# Altium project RGB-Cube.PrjPcb
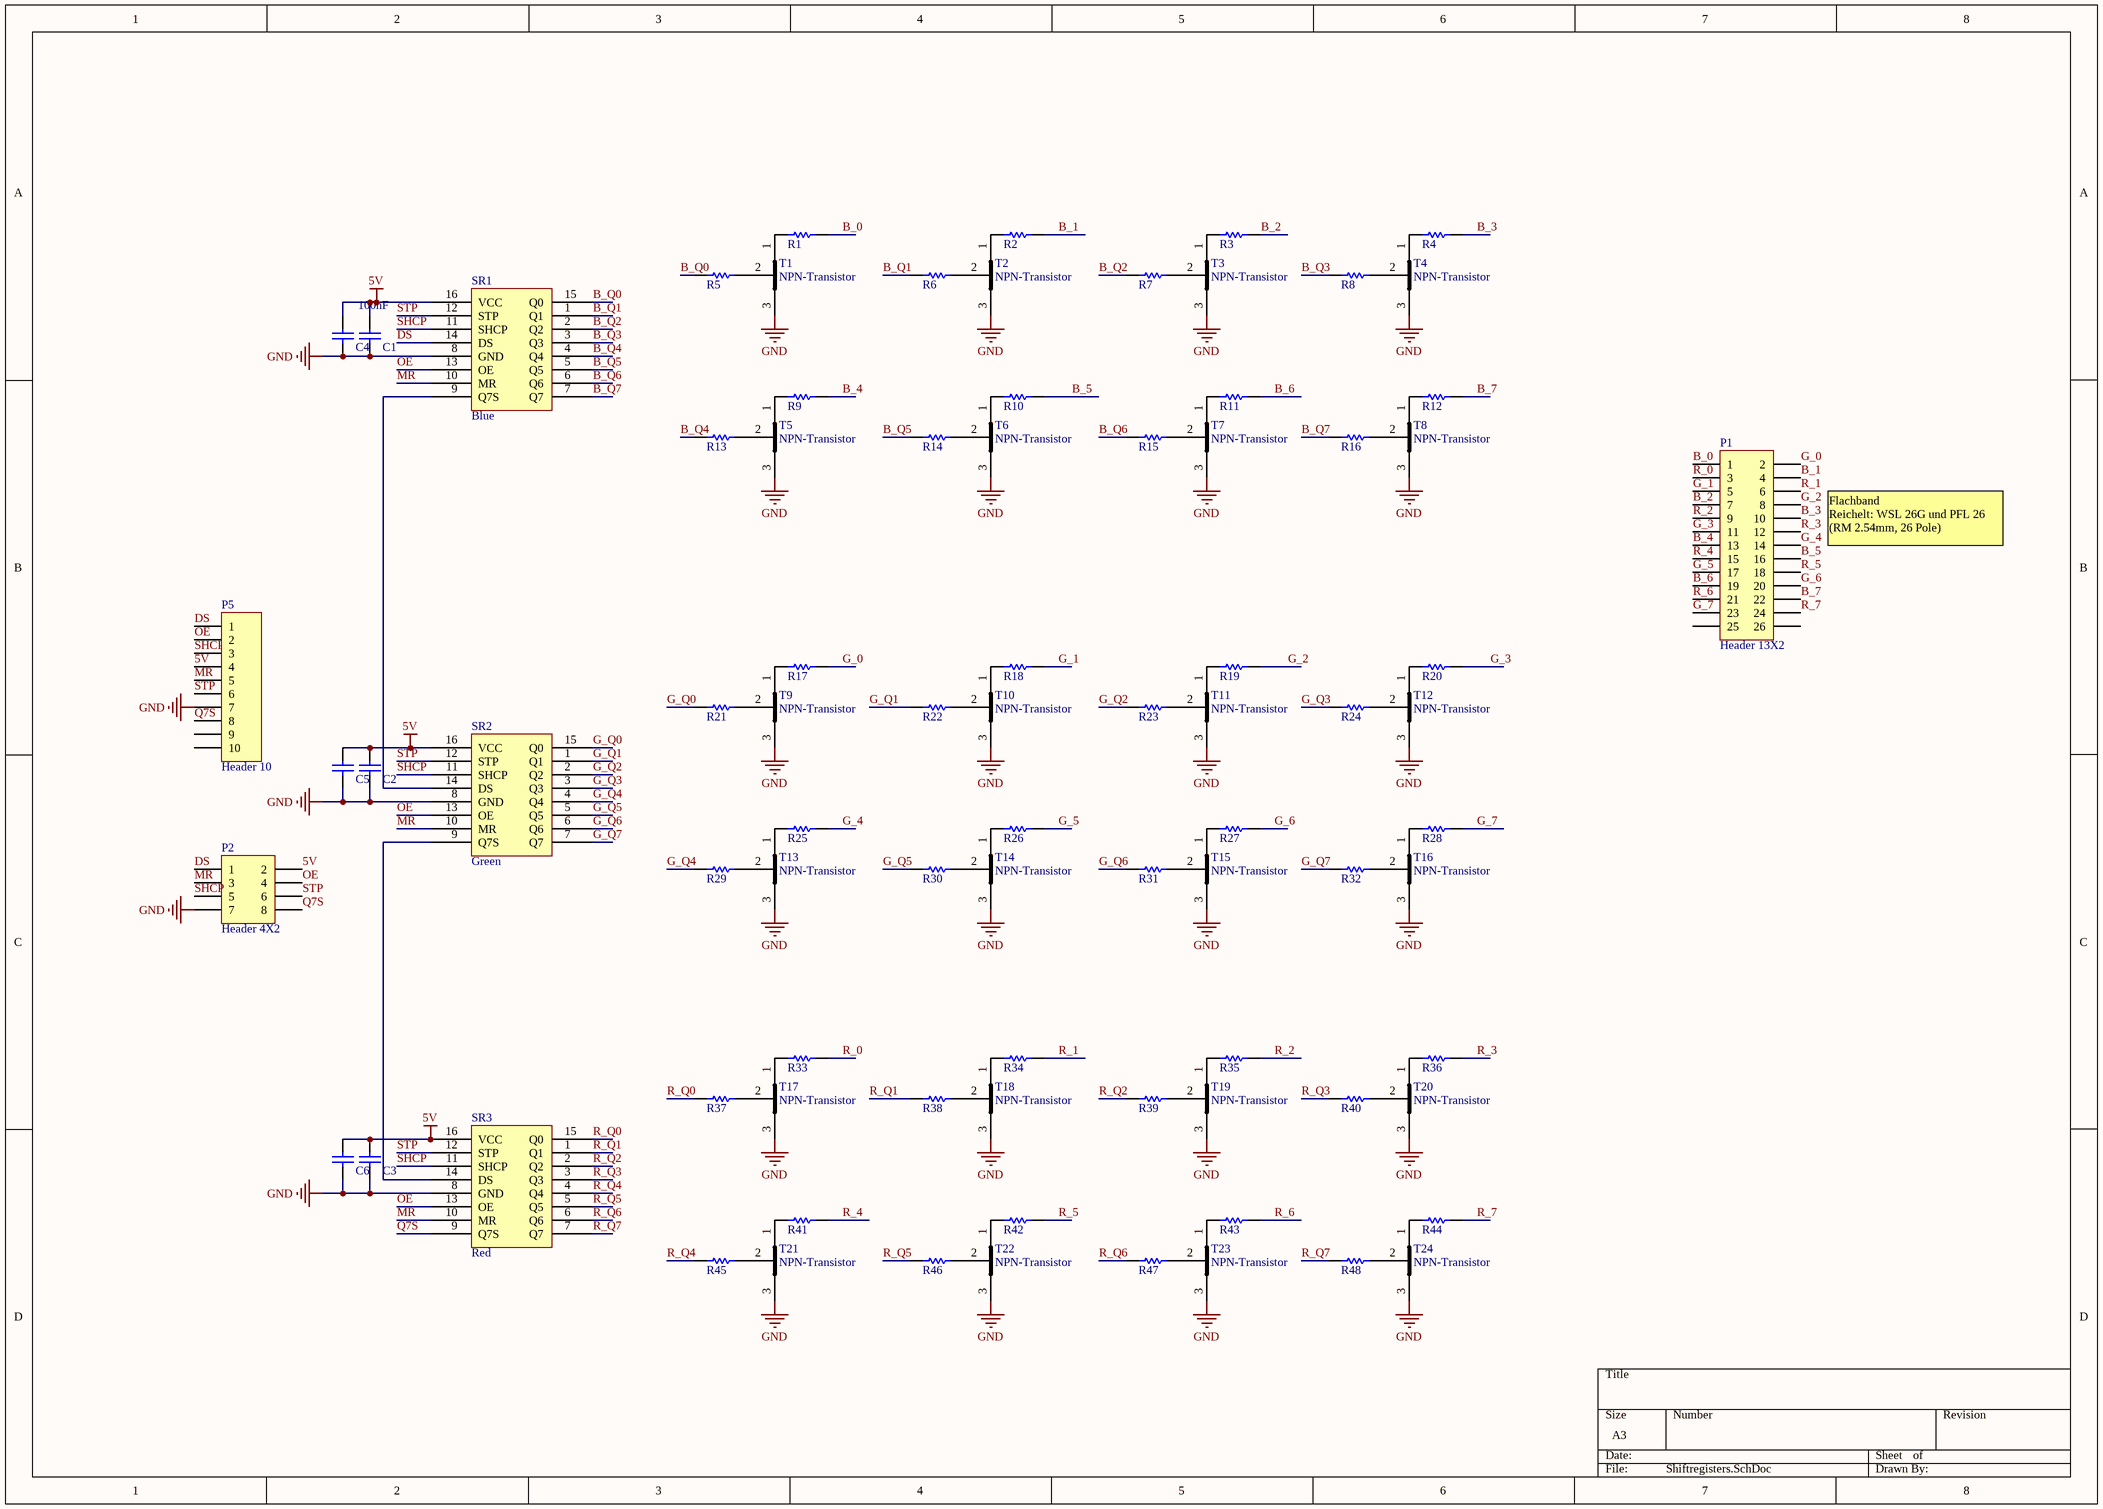
[diagram p0: Shiftregisters.SchDoc]
1 sheet, 84 parts. Net scope: global (net labels, ports and power ports of the same name join across sheets).
Board file: Shiftregisters.PcbDoc

## Sheet Shiftregisters.SchDoc
size A3

### Parts
C1  value 100nF  [CAPC1206(3216)190_L]  (hidden comment: CAP 100nF 16V 1206(3216))
C2  CAP 100nF 16V 1206(3216)  [CAPC1206(3216)190_L]  (value not drawn)
C3  CAP 100nF 16V 1206(3216)  [CAPC1206(3216)190_L]  (value not drawn)
C4  CAP 1uF 16V 1206(3216)  [CAPC1206(3216)150_N]  (value not drawn)
C5  CAP 1uF 16V 1206(3216)  [CAPC1206(3216)150_N]  (value not drawn)
C6  CAP 1uF 16V 1206(3216)  [CAPC1206(3216)150_N]  (value not drawn)
P1  Header 13X2  [HDR2X13]
P2  Header 4X2  [HDR2X4]
P5  Header 10  [10Pol Phoenix]
R1  2R 5% 1206(3216)  [RESC1206(3216)_M]  (value not drawn)
R2  2R 5% 1206(3216)  [RESC1206(3216)_M]  (value not drawn)
R3  2R 5% 1206(3216)  [RESC1206(3216)_M]  (value not drawn)
R4  2R 5% 1206(3216)  [RESC1206(3216)_M]  (value not drawn)
R5  2R 5% 1206(3216)  [RESC1206(3216)_M]  (value not drawn)
R6  2R 5% 1206(3216)  [RESC1206(3216)_M]  (value not drawn)
R7  2R 5% 1206(3216)  [RESC1206(3216)_M]  (value not drawn)
R8  2R 5% 1206(3216)  [RESC1206(3216)_M]  (value not drawn)
R9  2R 5% 1206(3216)  [RESC1206(3216)_M]  (value not drawn)
R10  2R 5% 1206(3216)  [RESC1206(3216)_M]  (value not drawn)
R11  2R 5% 1206(3216)  [RESC1206(3216)_M]  (value not drawn)
R12  2R 5% 1206(3216)  [RESC1206(3216)_M]  (value not drawn)
R13  2R 5% 1206(3216)  [RESC1206(3216)_M]  (value not drawn)
R14  2R 5% 1206(3216)  [RESC1206(3216)_M]  (value not drawn)
R15  2R 5% 1206(3216)  [RESC1206(3216)_M]  (value not drawn)
R16  2R 5% 1206(3216)  [RESC1206(3216)_M]  (value not drawn)
R17  2R 5% 1206(3216)  [RESC1206(3216)_M]  (value not drawn)
R18  2R 5% 1206(3216)  [RESC1206(3216)_M]  (value not drawn)
R19  2R 5% 1206(3216)  [RESC1206(3216)_M]  (value not drawn)
R20  2R 5% 1206(3216)  [RESC1206(3216)_M]  (value not drawn)
R21  2R 5% 1206(3216)  [RESC1206(3216)_M]  (value not drawn)
R22  2R 5% 1206(3216)  [RESC1206(3216)_M]  (value not drawn)
R23  2R 5% 1206(3216)  [RESC1206(3216)_M]  (value not drawn)
R24  2R 5% 1206(3216)  [RESC1206(3216)_M]  (value not drawn)
R25  2R 5% 1206(3216)  [RESC1206(3216)_M]  (value not drawn)
R26  2R 5% 1206(3216)  [RESC1206(3216)_M]  (value not drawn)
R27  2R 5% 1206(3216)  [RESC1206(3216)_M]  (value not drawn)
R28  2R 5% 1206(3216)  [RESC1206(3216)_M]  (value not drawn)
R29  2R 5% 1206(3216)  [RESC1206(3216)_M]  (value not drawn)
R30  2R 5% 1206(3216)  [RESC1206(3216)_M]  (value not drawn)
R31  2R 5% 1206(3216)  [RESC1206(3216)_M]  (value not drawn)
R32  2R 5% 1206(3216)  [RESC1206(3216)_M]  (value not drawn)
R33  2R 5% 1206(3216)  [RESC1206(3216)_M]  (value not drawn)
R34  2R 5% 1206(3216)  [RESC1206(3216)_M]  (value not drawn)
R35  2R 5% 1206(3216)  [RESC1206(3216)_M]  (value not drawn)
R36  2R 5% 1206(3216)  [RESC1206(3216)_M]  (value not drawn)
R37  2R 5% 1206(3216)  [RESC1206(3216)_M]  (value not drawn)
R38  2R 5% 1206(3216)  [RESC1206(3216)_M]  (value not drawn)
R39  2R 5% 1206(3216)  [RESC1206(3216)_M]  (value not drawn)
R40  2R 5% 1206(3216)  [RESC1206(3216)_M]  (value not drawn)
R41  2R 5% 1206(3216)  [RESC1206(3216)_M]  (value not drawn)
R42  2R 5% 1206(3216)  [RESC1206(3216)_M]  (value not drawn)
R43  2R 5% 1206(3216)  [RESC1206(3216)_M]  (value not drawn)
R44  2R 5% 1206(3216)  [RESC1206(3216)_M]  (value not drawn)
R45  2R 5% 1206(3216)  [RESC1206(3216)_M]  (value not drawn)
R46  2R 5% 1206(3216)  [RESC1206(3216)_M]  (value not drawn)
R47  2R 5% 1206(3216)  [RESC1206(3216)_M]  (value not drawn)
R48  2R 5% 1206(3216)  [RESC1206(3216)_M]  (value not drawn)
SR1  Blue  [SOP16]
SR2  Green  [SOP16]
SR3  Red  [SOP16]
T1  NPN-Transistor  [2N3904 - duplicate]
T2  NPN-Transistor  [2N3904 - duplicate]
T3  NPN-Transistor  [2N3904 - duplicate]
T4  NPN-Transistor  [2N3904 - duplicate]
T5  NPN-Transistor  [2N3904 - duplicate]
T6  NPN-Transistor  [2N3904 - duplicate]
T7  NPN-Transistor  [2N3904 - duplicate]
T8  NPN-Transistor  [2N3904 - duplicate]
T9  NPN-Transistor  [2N3904 - duplicate]
T10  NPN-Transistor  [2N3904 - duplicate]
T11  NPN-Transistor  [2N3904 - duplicate]
T12  NPN-Transistor  [2N3904 - duplicate]
T13  NPN-Transistor  [2N3904 - duplicate]
T14  NPN-Transistor  [2N3904 - duplicate]
T15  NPN-Transistor  [2N3904 - duplicate]
T16  NPN-Transistor  [2N3904 - duplicate]
T17  NPN-Transistor  [2N3904 - duplicate]
T18  NPN-Transistor  [2N3904 - duplicate]
T19  NPN-Transistor  [2N3904 - duplicate]
T20  NPN-Transistor  [2N3904 - duplicate]
T21  NPN-Transistor  [2N3904 - duplicate]
T22  NPN-Transistor  [2N3904 - duplicate]
T23  NPN-Transistor  [2N3904 - duplicate]
T24  NPN-Transistor  [2N3904 - duplicate]

### Nets
5V: C1.2 C2.1 C3.2 C4.2 C5.2 C6.2 P2.2 P5.4 SR1.16(VCC) SR2.16(VCC) SR3.16(VCC)
GND: C1.1 C2.2 C3.1 C4.1 C5.1 C6.1 P2.7 P5.7 SR1.8(GND) SR2.8(GND) SR3.8(GND) T1.3 T2.3 T3.3 T4.3 T5.3 T6.3 T7.3 T8.3 T9.3 T10.3 T11.3 T12.3 T13.3 T14.3 T15.3 T16.3 T17.3 T18.3 T19.3 T20.3 T21.3 T22.3 T23.3 T24.3
B_0: P1.1 R1.1
B_1: P1.4 R2.1
B_2: P1.7 R3.1
B_3: P1.10 R4.1
B_4: P1.13 R9.1
B_5: P1.16 R10.1
B_6: P1.19 R11.1
B_7: P1.22 R12.1
B_Q0: R5.1 SR1.15(Q0)
B_Q1: R6.1 SR1.1(Q1)
B_Q2: R7.1 SR1.2(Q2)
B_Q3: R8.1 SR1.3(Q3)
B_Q4: R13.1 SR1.4(Q4)
B_Q5: R14.1 SR1.5(Q5)
B_Q6: R15.1 SR1.6(Q6)
B_Q7: R16.1 SR1.7(Q7)
DS: P2.1 P5.1 SR1.14(DS)
G_0: P1.2 R17.1
G_1: P1.5 R18.1
G_2: P1.8 R19.1
G_3: P1.11 R20.1
G_4: P1.14 R25.1
G_5: P1.17 R26.1
G_6: P1.20 R27.1
G_7: P1.23 R28.1
G_Q0: R21.1 SR2.15(Q0)
G_Q1: R22.1 SR2.1(Q1)
G_Q2: R23.1 SR2.2(Q2)
G_Q3: R24.1 SR2.3(Q3)
G_Q4: R29.1 SR2.4(Q4)
G_Q5: R30.1 SR2.5(Q5)
G_Q6: R31.1 SR2.6(Q6)
G_Q7: R32.1 SR2.7(Q7)
MR: P2.3 P5.5 SR1.10(MR) SR2.10(MR) SR3.10(MR)
OE: P2.4 P5.2 SR1.13(OE) SR2.13(OE) SR3.13(OE)
Q7S: P2.8 P5.8 SR3.9(Q7S)
R_0: P1.3 R33.1
R_1: P1.6 R34.1
R_2: P1.9 R35.1
R_3: P1.12 R36.1
R_4: P1.15 R41.1
R_5: P1.18 R42.1
R_6: P1.21 R43.1
R_7: P1.24 R44.1
R_Q0: R37.1 SR3.15(Q0)
R_Q1: R38.1 SR3.1(Q1)
R_Q2: R39.1 SR3.2(Q2)
R_Q3: R40.1 SR3.3(Q3)
R_Q4: R45.1 SR3.4(Q4)
R_Q5: R46.1 SR3.5(Q5)
R_Q6: R47.1 SR3.6(Q6)
R_Q7: R48.1 SR3.7(Q7)
SHCP: P2.5 P5.3 SR1.11(SHCP) SR2.11(SHCP) SR3.11(SHCP)
STP: P2.6 P5.6 SR1.12(STP) SR2.12(STP) SR3.12(STP)
NetR1_2: R1.2 T1.1
NetR2_2: R2.2 T2.1
NetR3_2: R3.2 T3.1
NetR4_2: R4.2 T4.1
NetR5_2: R5.2 T1.2
NetR6_2: R6.2 T2.2
NetR7_2: R7.2 T3.2
NetR8_2: R8.2 T4.2
NetR9_2: R9.2 T5.1
NetR10_2: R10.2 T6.1
NetR11_2: R11.2 T7.1
NetR12_2: R12.2 T8.1
NetR13_2: R13.2 T5.2
NetR14_2: R14.2 T6.2
NetR15_2: R15.2 T7.2
NetR16_2: R16.2 T8.2
NetR17_2: R17.2 T9.1
NetR18_2: R18.2 T10.1
NetR19_2: R19.2 T11.1
NetR20_2: R20.2 T12.1
NetR21_2: R21.2 T9.2
NetR22_2: R22.2 T10.2
NetR23_2: R23.2 T11.2
NetR24_2: R24.2 T12.2
NetR25_2: R25.2 T13.1
NetR26_2: R26.2 T14.1
NetR27_2: R27.2 T15.1
NetR28_2: R28.2 T16.1
NetR29_2: R29.2 T13.2
NetR30_2: R30.2 T14.2
NetR31_2: R31.2 T15.2
NetR32_2: R32.2 T16.2
NetR33_2: R33.2 T17.1
NetR34_2: R34.2 T18.1
NetR35_2: R35.2 T19.1
NetR36_2: R36.2 T20.1
NetR37_2: R37.2 T17.2
NetR38_2: R38.2 T18.2
NetR39_2: R39.2 T19.2
NetR40_2: R40.2 T20.2
NetR41_2: R41.2 T21.1
NetR42_2: R42.2 T22.1
NetR43_2: R43.2 T23.1
NetR44_2: R44.2 T24.1
NetR45_2: R45.2 T21.2
NetR46_2: R46.2 T22.2
NetR47_2: R47.2 T23.2
NetR48_2: R48.2 T24.2
NetSR1_9: SR1.9(Q7S) SR2.14(DS)
NetSR2_9: SR2.9(Q7S) SR3.14(DS)

Not connected (* = marked no-connect by the designer): P1 25 26; P5 9 10

### Notes on the sheet
- Flachband
  Reichelt: WSL 26G und PFL 26
  (RM 2.54mm, 26 Pole)

### Library data of the parts
C1-C3 = CMP-1037-04176-1: CAP 100nF 16V Â±1% 1206 (3216 Metric) Thickness 1.9mm SMD; Case-Metric: 3216; Case-EIA: 1206; Max Thickness: 1.9 mm; Rated Voltage: 16 V; Technology: SMT; Tolerance: Â±1%
  C2 C3: Value: 100nF
C4-C6 = CMP-1037-04681-1: CAP 1uF 16V Â±5% 1206 (3216 Metric) Thickness 1.45mm SMD; Case-EIA: 1206; Case-Metric: 3216; Max Thickness: 1.45 mm; Value: 1uF; Tolerance: Â±5%; Rated Voltage: 16 V; Technology: SMT
P1 = Header 13X2: Header, 13-Pin, Dual row; LatestRevisionDate: 17-Jul-2002; LatestRevisionNote: Re-released for DXP Platform.; Publisher: Altium Limited
P2 = Header 4X2: Header, 4-Pin, Dual row; LatestRevisionDate: 17-Jul-2002; LatestRevisionNote: Re-released for DXP Platform.; Publisher: Altium Limited
P5 = Header 10: Header, 10-Pin; LatestRevisionDate: 17-Jul-2002; LatestRevisionNote: Re-released for DXP Platform.; Publisher: Altium Limited
R1-R48 = CMP-1014-00009-1: 2R 0.25W 5% 1206 (3216 Metric)  SMD; Case-EIA: 1206; Value: 2.00 Ohm; Case-Metric: 3216; Technology: SMT; Tolerance: 5 %; Power: 0.25 W
SR1-SR3 = 74HC595: 74HC595 Farnell:  2098004